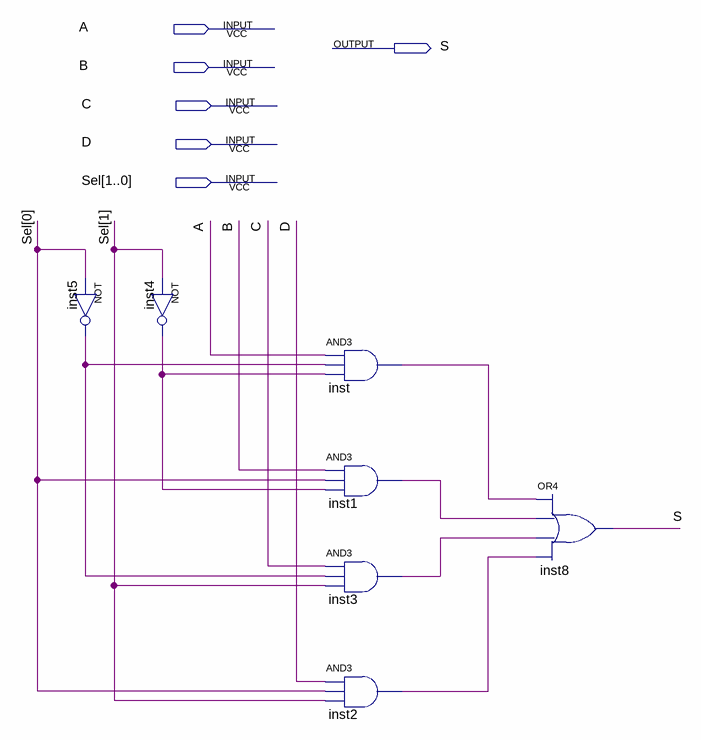
[diagram p0: schematic sheet]
// Quartus schematic MUX_41.bdf as structural Verilog: 7 symbols, 6 pins
module MUX_41 (
  input  A,
  input  B,
  input  C,
  input  D,
  input  [1:0] Sel,
  output S
);

  wire inst1_out, inst2_out, inst3_out, inst4_out, inst5_out, inst_out;

  not inst5 (inst5_out, Sel[0]);
  not inst4 (inst4_out, Sel[1]);
  and inst (inst_out, A, inst5_out, inst4_out);
  and inst1 (inst1_out, B, Sel[0], inst4_out);
  and inst3 (inst3_out, C, inst5_out, Sel[1]);
  and inst2 (inst2_out, D, Sel[0], Sel[1]);
  or inst8 (S, inst_out, inst1_out, inst3_out, inst2_out);
endmodule
